# Altium schematic sheet Power.SchDoc
size A4
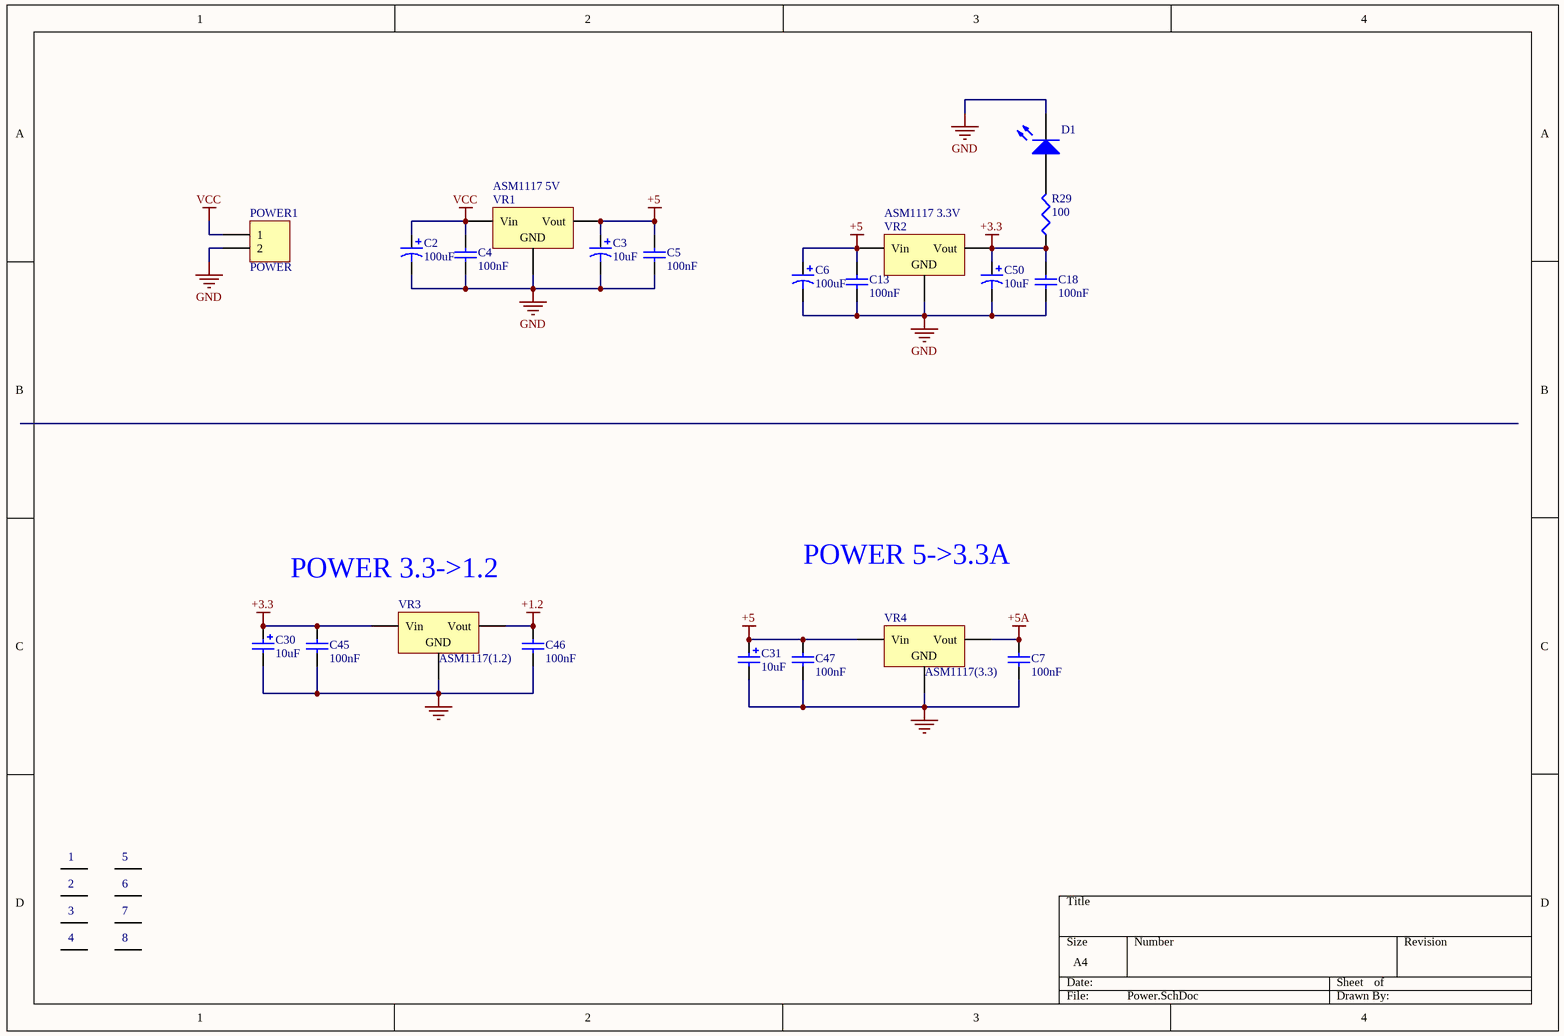
[diagram p0: Power.SchDoc]

## Parts
1  (no value)  [pad]
2  (no value)  [pad]
3  (no value)  [pad]
4  (no value)  [pad]
5  (no value)  [pad]
6  (no value)  [pad]
7  (no value)  [pad]
8  (no value)  [pad]
C2  100uf  [CAP470]
C3  10uf  [CAP1016]
C4  100nF  [1206]
C5  100nF  [1206]
C6  100uf  [CAP470]
C7  100nF  [1206]
C13  100nF  [1206]
C18  100nF  [1206]
C30  10uF  [CAP1016]
C31  10uF  [CAP1016]
C45  100nF  [1206]
C46  100nF  [1206]
C47  100nF  [1206]
C50  10uf  [CAP1016]
D1  LED0  [LED-0805]  (value not drawn)
POWER1  POWER  [power jack]
R29  100  [1206]
VR1  ASM1117 5V  [AMS117]
VR2  ASM1117 3.3V  [AMS117]
VR3  ASM1117(1.2)  [AMS117]
VR4  ASM1117(3.3)  [AMS117]

## Nets
+1.2: C46.1 VR3.4(Vout)
+3.3: C18.1 C30.1 C45.1 C50.1 R29.1 VR2.4(Vout) VR3.3(Vin)
+5: C3.1 C5.1 C6.1 C13.1 C31.1 C47.1 VR1.4(Vout) VR2.3(Vin) VR4.3(Vin)
+5A: C7.1 VR4.4(Vout)
GND: C2.2 C3.2 C4.2 C5.2 C6.2 C7.2 C13.2 C18.2 C30.2 C31.2 C45.2 C46.2 C47.2 C50.2 D1.2(K) POWER1.2 VR1.1(GND) VR2.1(GND) VR3.1(GND) VR4.1(GND)
VCC: C2.1 C4.1 POWER1.1 VR1.3(Vin)
NetD1_1: D1.1(A) R29.2

Not connected (* = marked no-connect by the designer): 1 1; 2 1; 3 1; 4 1; 5 1; 6 1; 7 1; 8 1

## Notes on the sheet
- POWER 3.3->1.2
- POWER 5->3.3A

## Library data of the parts
1-8 = PAD
C2 C3 C6 C30 C31 C50 = Cap Pol1: Polarized Capacitor (Radial); Published: 8-Jun-2000; Publisher: Altium Limited
  C2 C6: LatestRevisionDate: 17-Jul-2002; LatestRevisionNote: Re-released for DXP Platform.; PackageReference: RB7.6-15; Value: 100uF
  C3 C50: LatestRevisionDate: 17-Jul-2002; LatestRevisionNote: Re-released for DXP Platform.; PackageReference: RB7.6-15; Value: 10uF
  C30 C31: Revision: July-2002: Re-released for DXP Platform.; Value: 10uF
C4 C5 C13 C18 = Cap Semi: Capacitor (Semiconductor SIM Model); Published: 8-Jun-2000; LatestRevisionDate: 29-May-2009; LatestRevisionNote: IPC-7351 Footprint Added.; PackageReference: 0603C; Publisher: Altium Limited; PackageDescription: Chip Capacitor; Value: 100nF
C7 C45-C47 = Cap: Capacitor; Published: 8-Jun-2000; Revision: July-2002: Re-released for DXP Platform.; Publisher: Altium Limited; Value: 100nF
D1 = LED0: Typical INFRARED GaAs LED; Published: 8-Jun-2000; LatestRevisionDate: 08-Jul-2005; LatestRevisionNote: Mech Layer 1 removed.; PackageReference: LED-0; Publisher: Altium Limited
POWER1 = Header 2H: Header, 2-Pin, Right Angle; LatestRevisionDate: 17-Jul-2002; LatestRevisionNote: Re-released for DXP Platform.; Publisher: Altium Limited
R29 = Res3: Resistor; Published: 8-Jun-2000; LatestRevisionDate: 29-May-2009; LatestRevisionNote: IPC-7351 Footprint Added.; PackageReference: J1-0603; Publisher: Altium Limited; PackageDescription: Chip Resistor; Value: 100
VR1-VR4 = Volt Reg_1: Voltage Regulator; Published: 24-Mar-1999; LatestRevisionDate: 29-May-2009; LatestRevisionNote: IPC-7351 Footprint Added.; PackageReference: D2PAK; Publisher: Altium Limited; PackageDescription: 3-Pin Transistor Outline Package 2.54 mm Pitch, 15.1 mm Lead Span